# EAGLE schematic muneeb_v3 (EAGLE 9.7.0)
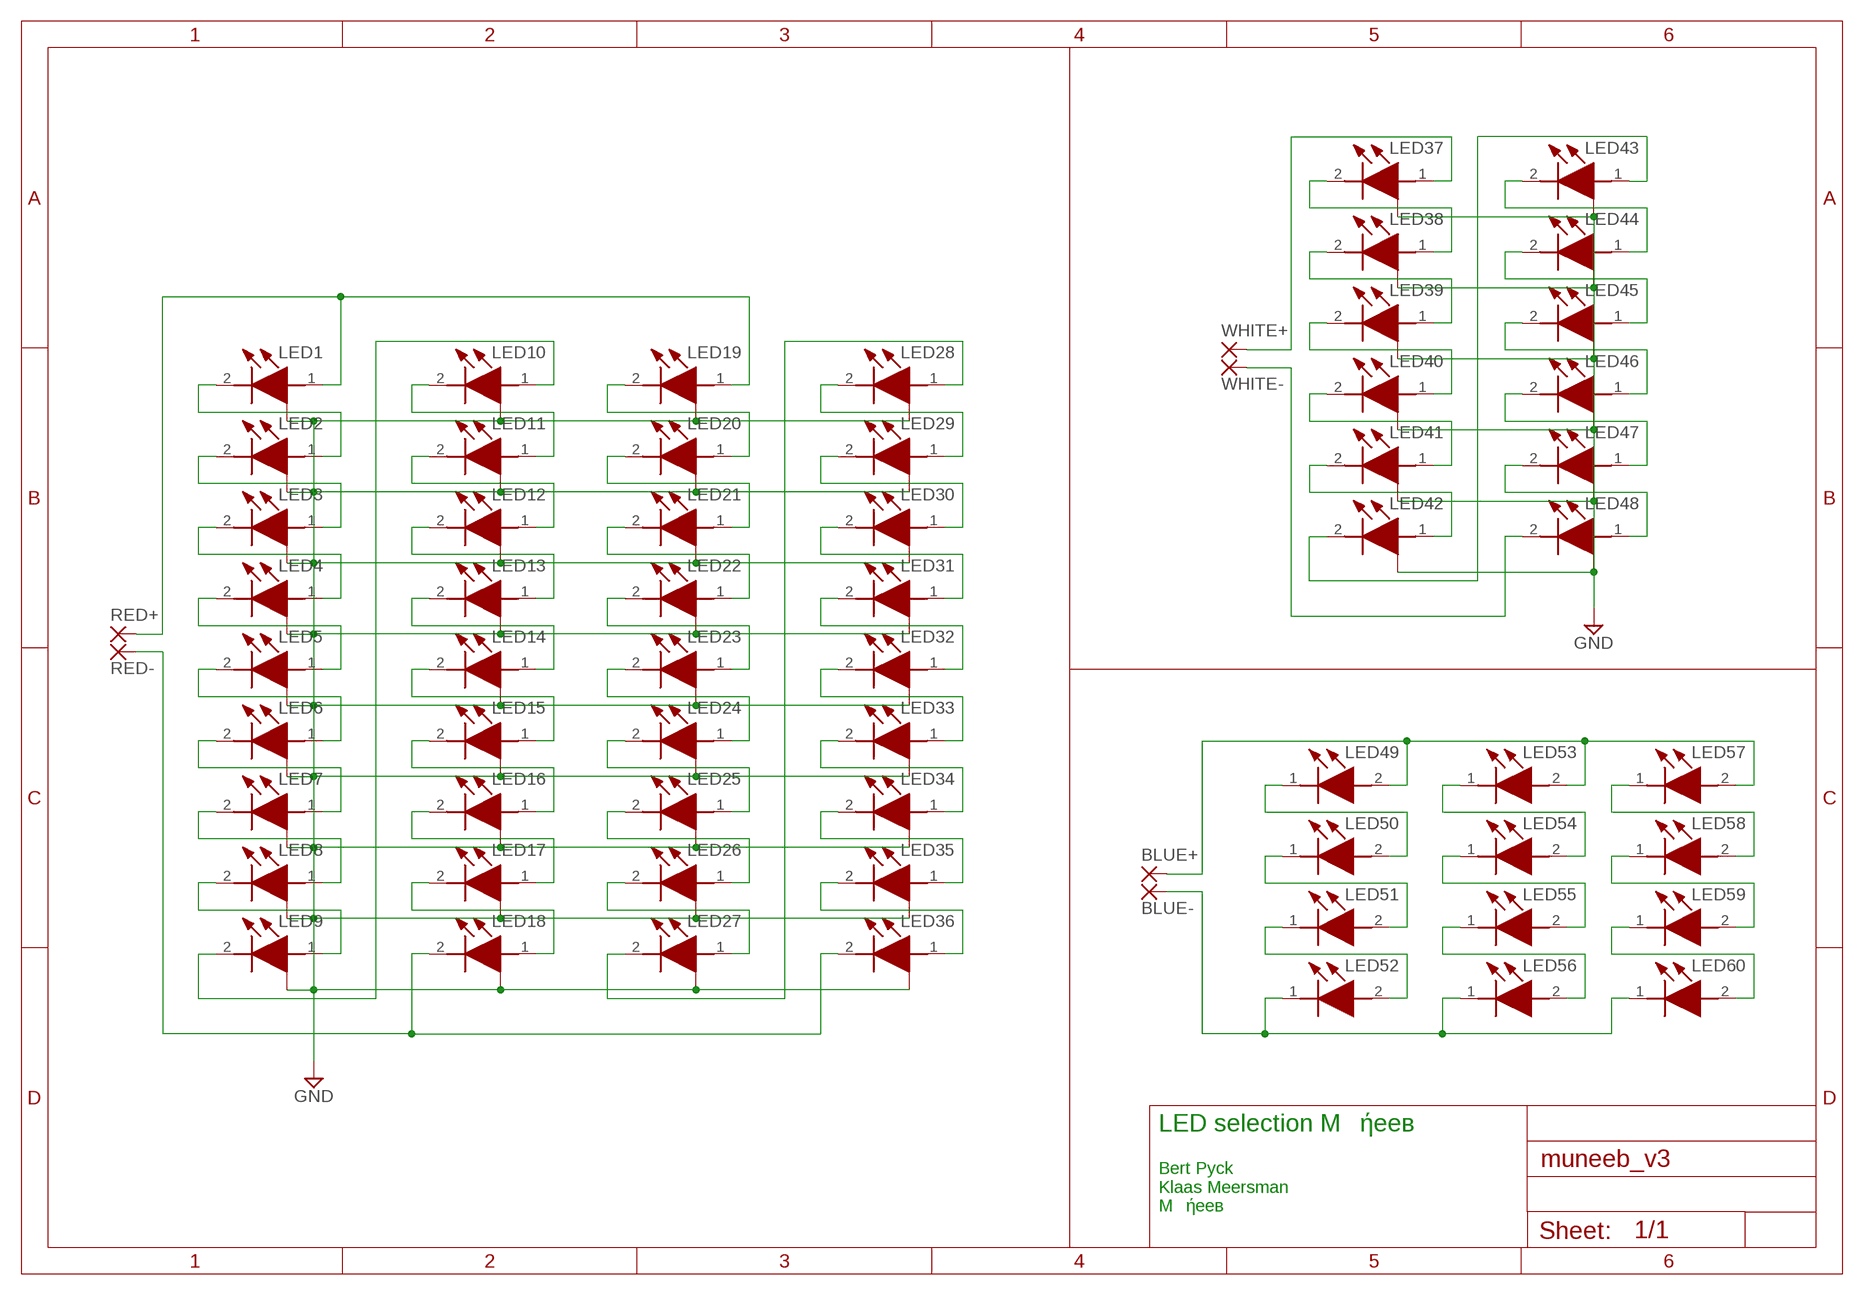
[diagram p0: schematic, sheet 1]

## Parts
BLUE+  SOLDERPAD  [SOLDERPAD]
BLUE-  SOLDERPAD  [SOLDERPAD]
LED1  RED  [GR_CSSRML.24]
LED2  RED  [GR_CSSRML.24]
LED3  RED  [GR_CSSRML.24]
LED4  RED  [GR_CSSRML.24]
LED5  RED  [GR_CSSRML.24]
LED6  RED  [GR_CSSRML.24]
LED7  RED  [GR_CSSRML.24]
LED8  RED  [GR_CSSRML.24]
LED9  RED  [GR_CSSRML.24]
LED10  RED  [GR_CSSRML.24]
LED11  RED  [GR_CSSRML.24]
LED12  RED  [GR_CSSRML.24]
LED13  RED  [GR_CSSRML.24]
LED14  RED  [GR_CSSRML.24]
LED15  RED  [GR_CSSRML.24]
LED16  RED  [GR_CSSRML.24]
LED17  RED  [GR_CSSRML.24]
LED18  RED  [GR_CSSRML.24]
LED19  RED  [GR_CSSRML.24]
LED20  RED  [GR_CSSRML.24]
LED21  RED  [GR_CSSRML.24]
LED22  RED  [GR_CSSRML.24]
LED23  RED  [GR_CSSRML.24]
LED24  RED  [GR_CSSRML.24]
LED25  RED  [GR_CSSRML.24]
LED26  RED  [GR_CSSRML.24]
LED27  RED  [GR_CSSRML.24]
LED28  RED  [GR_CSSRML.24]
LED29  RED  [GR_CSSRML.24]
LED30  RED  [GR_CSSRML.24]
LED31  RED  [GR_CSSRML.24]
LED32  RED  [GR_CSSRML.24]
LED33  RED  [GR_CSSRML.24]
LED34  RED  [GR_CSSRML.24]
LED35  RED  [GR_CSSRML.24]
LED36  RED  [GR_CSSRML.24]
LED37  WHITE  [GR_CSSRML.24]
LED38  WHITE  [GR_CSSRML.24]
LED39  WHITE  [GR_CSSRML.24]
LED40  WHITE  [GR_CSSRML.24]
LED41  WHITE  [GR_CSSRML.24]
LED42  WHITE  [GR_CSSRML.24]
LED43  WHITE  [GR_CSSRML.24]
LED44  WHITE  [GR_CSSRML.24]
LED45  WHITE  [GR_CSSRML.24]
LED46  WHITE  [GR_CSSRML.24]
LED47  WHITE  [GR_CSSRML.24]
LED48  WHITE  [GR_CSSRML.24]
LED49  BLUE  [GD_JTLPSI1.14]
LED50  BLUE  [GD_JTLPSI1.14]
LED51  BLUE  [GD_JTLPSI1.14]
LED52  BLUE  [GD_JTLPSI1.14]
LED53  BLUE  [GD_JTLPSI1.14]
LED54  BLUE  [GD_JTLPSI1.14]
LED55  BLUE  [GD_JTLPSI1.14]
LED56  BLUE  [GD_JTLPSI1.14]
LED57  BLUE  [GD_JTLPSI1.14]
LED58  BLUE  [GD_JTLPSI1.14]
LED59  BLUE  [GD_JTLPSI1.14]
LED60  BLUE  [GD_JTLPSI1.14]
RED+  SOLDERPAD  [SOLDERPAD]
RED-  SOLDERPAD  [SOLDERPAD]
WHITE+  SOLDERPAD  [SOLDERPAD]
WHITE-  SOLDERPAD  [SOLDERPAD]

## Nets
GND: LED1.GND LED1.P$1(GND) LED1.P$3(GND) LED1.P$5(GND) LED1.P$6(GND) LED1.P$7(GND) LED1.P$8(GND) LED1.P$9(GND) LED1.P$11(GND) LED1.P$12(GND) LED1.P$13(GND) LED1.P$14(GND) LED1.P$15(GND) LED2.GND LED2.P$1(GND) LED2.P$3(GND) LED2.P$5(GND) LED2.P$6(GND) LED2.P$7(GND) LED2.P$8(GND) LED2.P$9(GND) LED2.P$11(GND) LED2.P$12(GND) LED2.P$13(GND) LED2.P$14(GND) LED2.P$15(GND) LED3.GND LED3.P$1(GND) LED3.P$3(GND) LED3.P$5(GND) LED3.P$6(GND) LED3.P$7(GND) LED3.P$8(GND) LED3.P$9(GND) LED3.P$11(GND) LED3.P$12(GND) LED3.P$13(GND) LED3.P$14(GND) LED3.P$15(GND) LED4.GND LED4.P$1(GND) LED4.P$3(GND) LED4.P$5(GND) LED4.P$6(GND) LED4.P$7(GND) LED4.P$8(GND) LED4.P$9(GND) LED4.P$11(GND) LED4.P$12(GND) LED4.P$13(GND) LED4.P$14(GND) LED4.P$15(GND) LED5.GND LED5.P$1(GND) LED5.P$3(GND) LED5.P$5(GND) LED5.P$6(GND) LED5.P$7(GND) LED5.P$8(GND) LED5.P$9(GND) LED5.P$11(GND) LED5.P$12(GND) LED5.P$13(GND) LED5.P$14(GND) LED5.P$15(GND) LED6.GND LED6.P$1(GND) LED6.P$3(GND) LED6.P$5(GND) LED6.P$6(GND) LED6.P$7(GND) LED6.P$8(GND) LED6.P$9(GND) LED6.P$11(GND) LED6.P$12(GND) LED6.P$13(GND) LED6.P$14(GND) LED6.P$15(GND) LED7.GND LED7.P$1(GND) LED7.P$3(GND) LED7.P$5(GND) LED7.P$6(GND) LED7.P$7(GND) LED7.P$8(GND) LED7.P$9(GND) LED7.P$11(GND) LED7.P$12(GND) LED7.P$13(GND) LED7.P$14(GND) LED7.P$15(GND) LED8.GND LED8.P$1(GND) LED8.P$3(GND) LED8.P$5(GND) LED8.P$6(GND) LED8.P$7(GND) LED8.P$8(GND) LED8.P$9(GND) LED8.P$11(GND) LED8.P$12(GND) LED8.P$13(GND) LED8.P$14(GND) LED8.P$15(GND) LED9.GND LED9.P$1(GND) LED9.P$3(GND) LED9.P$5(GND) LED9.P$6(GND) LED9.P$7(GND) LED9.P$8(GND) LED9.P$9(GND) LED9.P$11(GND) LED9.P$12(GND) LED9.P$13(GND) LED9.P$14(GND) LED9.P$15(GND) LED10.GND LED10.P$1(GND) LED10.P$3(GND) LED10.P$5(GND) LED10.P$6(GND) LED10.P$7(GND) LED10.P$8(GND) LED10.P$9(GND) LED10.P$11(GND) LED10.P$12(GND) LED10.P$13(GND) LED10.P$14(GND) LED10.P$15(GND) LED11.GND LED11.P$1(GND) LED11.P$3(GND) LED11.P$5(GND) LED11.P$6(GND) LED11.P$7(GND) LED11.P$8(GND) LED11.P$9(GND) LED11.P$11(GND) LED11.P$12(GND) LED11.P$13(GND) LED11.P$14(GND) LED11.P$15(GND) LED12.GND LED12.P$1(GND) LED12.P$3(GND) LED12.P$5(GND) LED12.P$6(GND) LED12.P$7(GND) LED12.P$8(GND) LED12.P$9(GND) LED12.P$11(GND) LED12.P$12(GND) LED12.P$13(GND) LED12.P$14(GND) LED12.P$15(GND) LED13.GND LED13.P$1(GND) LED13.P$3(GND) LED13.P$5(GND) LED13.P$6(GND) LED13.P$7(GND) LED13.P$8(GND) LED13.P$9(GND) LED13.P$11(GND) LED13.P$12(GND) LED13.P$13(GND) LED13.P$14(GND) LED13.P$15(GND) LED14.GND LED14.P$1(GND) LED14.P$3(GND) LED14.P$5(GND) LED14.P$6(GND) LED14.P$7(GND) LED14.P$8(GND) LED14.P$9(GND) LED14.P$11(GND) LED14.P$12(GND) LED14.P$13(GND) LED14.P$14(GND) LED14.P$15(GND) LED15.GND LED15.P$1(GND) LED15.P$3(GND) LED15.P$5(GND) LED15.P$6(GND) LED15.P$7(GND) LED15.P$8(GND) LED15.P$9(GND) LED15.P$11(GND) LED15.P$12(GND) LED15.P$13(GND) LED15.P$14(GND) LED15.P$15(GND) LED16.GND LED16.P$1(GND) LED16.P$3(GND) LED16.P$5(GND) LED16.P$6(GND) LED16.P$7(GND) LED16.P$8(GND) LED16.P$9(GND) LED16.P$11(GND) LED16.P$12(GND) LED16.P$13(GND) LED16.P$14(GND) LED16.P$15(GND) LED17.GND LED17.P$1(GND) LED17.P$3(GND) LED17.P$5(GND) LED17.P$6(GND) LED17.P$7(GND) LED17.P$8(GND) LED17.P$9(GND) LED17.P$11(GND) LED17.P$12(GND) LED17.P$13(GND) LED17.P$14(GND) LED17.P$15(GND) LED18.GND LED18.P$1(GND) LED18.P$3(GND) LED18.P$5(GND) LED18.P$6(GND) LED18.P$7(GND) LED18.P$8(GND) LED18.P$9(GND) LED18.P$11(GND) LED18.P$12(GND) LED18.P$13(GND) LED18.P$14(GND) LED18.P$15(GND) LED19.GND LED19.P$1(GND) LED19.P$3(GND) LED19.P$5(GND) LED19.P$6(GND) LED19.P$7(GND) LED19.P$8(GND) LED19.P$9(GND) LED19.P$11(GND) LED19.P$12(GND) LED19.P$13(GND) LED19.P$14(GND) LED19.P$15(GND) LED20.GND LED20.P$1(GND) LED20.P$3(GND) LED20.P$5(GND) LED20.P$6(GND) LED20.P$7(GND) LED20.P$8(GND) LED20.P$9(GND) LED20.P$11(GND) LED20.P$12(GND) LED20.P$13(GND) LED20.P$14(GND) LED20.P$15(GND) LED21.GND LED21.P$1(GND) LED21.P$3(GND) LED21.P$5(GND) LED21.P$6(GND) LED21.P$7(GND) LED21.P$8(GND) LED21.P$9(GND) LED21.P$11(GND) LED21.P$12(GND) LED21.P$13(GND) LED21.P$14(GND) LED21.P$15(GND) LED22.GND LED22.P$1(GND) LED22.P$3(GND) LED22.P$5(GND) LED22.P$6(GND) LED22.P$7(GND) LED22.P$8(GND) LED22.P$9(GND) LED22.P$11(GND) LED22.P$12(GND) LED22.P$13(GND) LED22.P$14(GND) LED22.P$15(GND) LED23.GND LED23.P$1(GND) LED23.P$3(GND) LED23.P$5(GND) LED23.P$6(GND) LED23.P$7(GND) LED23.P$8(GND) LED23.P$9(GND) LED23.P$11(GND) LED23.P$12(GND) LED23.P$13(GND) LED23.P$14(GND) LED23.P$15(GND) LED24.GND LED24.P$1(GND) LED24.P$3(GND) LED24.P$5(GND) LED24.P$6(GND) LED24.P$7(GND) LED24.P$8(GND) LED24.P$9(GND) LED24.P$11(GND) LED24.P$12(GND) LED24.P$13(GND) LED24.P$14(GND) LED24.P$15(GND) LED25.GND LED25.P$1(GND) LED25.P$3(GND) LED25.P$5(GND) LED25.P$6(GND) LED25.P$7(GND) LED25.P$8(GND) LED25.P$9(GND) LED25.P$11(GND) LED25.P$12(GND) LED25.P$13(GND) LED25.P$14(GND) LED25.P$15(GND) LED26.GND LED26.P$1(GND) LED26.P$3(GND) LED26.P$5(GND) LED26.P$6(GND) LED26.P$7(GND) LED26.P$8(GND) LED26.P$9(GND) LED26.P$11(GND) LED26.P$12(GND) LED26.P$13(GND) LED26.P$14(GND) LED26.P$15(GND) LED27.GND LED27.P$1(GND) LED27.P$3(GND) LED27.P$5(GND) LED27.P$6(GND) LED27.P$7(GND) LED27.P$8(GND) LED27.P$9(GND) LED27.P$11(GND) LED27.P$12(GND) LED27.P$13(GND) LED27.P$14(GND) LED27.P$15(GND) LED28.GND LED28.P$1(GND) LED28.P$3(GND) LED28.P$5(GND) LED28.P$6(GND) LED28.P$7(GND) LED28.P$8(GND) LED28.P$9(GND) LED28.P$11(GND) LED28.P$12(GND) LED28.P$13(GND) LED28.P$14(GND) LED28.P$15(GND) LED29.GND LED29.P$1(GND) LED29.P$3(GND) LED29.P$5(GND) LED29.P$6(GND) LED29.P$7(GND) LED29.P$8(GND) LED29.P$9(GND) LED29.P$11(GND) LED29.P$12(GND) LED29.P$13(GND) LED29.P$14(GND) LED29.P$15(GND) LED30.GND LED30.P$1(GND) LED30.P$3(GND) LED30.P$5(GND) LED30.P$6(GND) LED30.P$7(GND) LED30.P$8(GND) LED30.P$9(GND) LED30.P$11(GND) LED30.P$12(GND) LED30.P$13(GND) LED30.P$14(GND) LED30.P$15(GND) LED31.GND LED31.P$1(GND) LED31.P$3(GND) LED31.P$5(GND) LED31.P$6(GND) LED31.P$7(GND) LED31.P$8(GND) LED31.P$9(GND) LED31.P$11(GND) LED31.P$12(GND) LED31.P$13(GND) LED31.P$14(GND) LED31.P$15(GND) LED32.GND LED32.P$1(GND) LED32.P$3(GND) LED32.P$5(GND) LED32.P$6(GND) LED32.P$7(GND) LED32.P$8(GND) LED32.P$9(GND) LED32.P$11(GND) LED32.P$12(GND) LED32.P$13(GND) LED32.P$14(GND) LED32.P$15(GND) LED33.GND LED33.P$1(GND) LED33.P$3(GND) LED33.P$5(GND) LED33.P$6(GND) LED33.P$7(GND) LED33.P$8(GND) LED33.P$9(GND) LED33.P$11(GND) LED33.P$12(GND) LED33.P$13(GND) LED33.P$14(GND) LED33.P$15(GND) LED34.GND LED34.P$1(GND) LED34.P$3(GND) LED34.P$5(GND) LED34.P$6(GND) LED34.P$7(GND) LED34.P$8(GND) LED34.P$9(GND) LED34.P$11(GND) LED34.P$12(GND) LED34.P$13(GND) LED34.P$14(GND) LED34.P$15(GND) LED35.GND LED35.P$1(GND) LED35.P$3(GND) LED35.P$5(GND) LED35.P$6(GND) LED35.P$7(GND) LED35.P$8(GND) LED35.P$9(GND) LED35.P$11(GND) LED35.P$12(GND) LED35.P$13(GND) LED35.P$14(GND) LED35.P$15(GND) LED36.GND LED36.P$1(GND) LED36.P$3(GND) LED36.P$5(GND) LED36.P$6(GND) LED36.P$7(GND) LED36.P$8(GND) LED36.P$9(GND) LED36.P$11(GND) LED36.P$12(GND) LED36.P$13(GND) LED36.P$14(GND) LED36.P$15(GND) LED37.GND LED37.P$1(GND) LED37.P$3(GND) LED37.P$5(GND) LED37.P$6(GND) LED37.P$7(GND) LED37.P$8(GND) LED37.P$9(GND) LED37.P$11(GND) LED37.P$12(GND) LED37.P$13(GND) LED37.P$14(GND) LED37.P$15(GND) LED38.GND LED38.P$1(GND) LED38.P$3(GND) LED38.P$5(GND) LED38.P$6(GND) LED38.P$7(GND) LED38.P$8(GND) LED38.P$9(GND) LED38.P$11(GND) LED38.P$12(GND) LED38.P$13(GND) LED38.P$14(GND) LED38.P$15(GND) LED39.GND LED39.P$1(GND) LED39.P$3(GND) LED39.P$5(GND) LED39.P$6(GND) LED39.P$7(GND) LED39.P$8(GND) LED39.P$9(GND) LED39.P$11(GND) LED39.P$12(GND) LED39.P$13(GND) LED39.P$14(GND) LED39.P$15(GND) LED40.GND LED40.P$1(GND) LED40.P$3(GND) LED40.P$5(GND) LED40.P$6(GND) LED40.P$7(GND) LED40.P$8(GND) LED40.P$9(GND) LED40.P$11(GND) LED40.P$12(GND) LED40.P$13(GND) LED40.P$14(GND) LED40.P$15(GND) LED41.GND LED41.P$1(GND) LED41.P$3(GND) LED41.P$5(GND) LED41.P$6(GND) LED41.P$7(GND) LED41.P$8(GND) LED41.P$9(GND) LED41.P$11(GND) LED41.P$12(GND) LED41.P$13(GND) LED41.P$14(GND) LED41.P$15(GND) LED42.GND LED42.P$1(GND) LED42.P$3(GND) LED42.P$5(GND) LED42.P$6(GND) LED42.P$7(GND) LED42.P$8(GND) LED42.P$9(GND) LED42.P$11(GND) LED42.P$12(GND) LED42.P$13(GND) LED42.P$14(GND) LED42.P$15(GND) LED43.GND LED43.P$1(GND) LED43.P$3(GND) LED43.P$5(GND) LED43.P$6(GND) LED43.P$7(GND) LED43.P$8(GND) LED43.P$9(GND) LED43.P$11(GND) LED43.P$12(GND) LED43.P$13(GND) LED43.P$14(GND) LED43.P$15(GND) LED44.GND LED44.P$1(GND) LED44.P$3(GND) LED44.P$5(GND) LED44.P$6(GND) LED44.P$7(GND) LED44.P$8(GND) LED44.P$9(GND) LED44.P$11(GND) LED44.P$12(GND) LED44.P$13(GND) LED44.P$14(GND) LED44.P$15(GND) LED45.GND LED45.P$1(GND) LED45.P$3(GND) LED45.P$5(GND) LED45.P$6(GND) LED45.P$7(GND) LED45.P$8(GND) LED45.P$9(GND) LED45.P$11(GND) LED45.P$12(GND) LED45.P$13(GND) LED45.P$14(GND) LED45.P$15(GND) LED46.GND LED46.P$1(GND) LED46.P$3(GND) LED46.P$5(GND) LED46.P$6(GND) LED46.P$7(GND) LED46.P$8(GND) LED46.P$9(GND) LED46.P$11(GND) LED46.P$12(GND) LED46.P$13(GND) LED46.P$14(GND) LED46.P$15(GND) LED47.GND LED47.P$1(GND) LED47.P$3(GND) LED47.P$5(GND) LED47.P$6(GND) LED47.P$7(GND) LED47.P$8(GND) LED47.P$9(GND) LED47.P$11(GND) LED47.P$12(GND) LED47.P$13(GND) LED47.P$14(GND) LED47.P$15(GND) LED48.GND LED48.P$1(GND) LED48.P$3(GND) LED48.P$5(GND) LED48.P$6(GND) LED48.P$7(GND) LED48.P$8(GND) LED48.P$9(GND) LED48.P$11(GND) LED48.P$12(GND) LED48.P$13(GND) LED48.P$14(GND) LED48.P$15(GND)
N$1: LED1.1(A) LED19.1(A) RED+.1(P)
N$2: LED1.2(K) LED2.1(A)
N$3: LED37.1(A) WHITE+.1(P)
N$4: LED48.2(K) WHITE-.1(P)
N$5: LED37.2(K) LED38.1(A)
N$6: LED38.2(K) LED39.1(A)
N$7: LED39.2(K) LED40.1(A)
N$8: LED40.2(K) LED41.1(A)
N$9: LED41.2(K) LED42.1(A)
N$10: LED42.2(K) LED43.1(A)
N$12: LED2.2(K) LED3.1(A)
N$13: LED3.2(K) LED4.1(A)
N$14: LED4.2(K) LED5.1(A)
N$15: LED5.2(K) LED6.1(A)
N$16: LED6.2(K) LED7.1(A)
N$17: LED43.2(K) LED44.1(A)
N$18: LED44.2(K) LED45.1(A)
N$19: LED45.2(K) LED46.1(A)
N$20: LED46.2(K) LED47.1(A)
N$21: BLUE+.1(P) LED49.2(A) LED53.2(A) LED57.2(A)
N$22: LED7.2(K) LED8.1(A)
N$23: BLUE-.1(P) LED52.1(K) LED56.1(K) LED60.1(K)
N$24: LED8.2(K) LED9.1(A)
N$25: LED10.2(K) LED11.1(A)
N$26: LED11.2(K) LED12.1(A)
N$27: LED12.2(K) LED13.1(A)
N$28: LED13.2(K) LED14.1(A)
N$29: LED49.1(K) LED50.2(A)
N$30: LED19.2(K) LED20.1(A)
N$31: LED20.2(K) LED21.1(A)
N$32: LED50.1(K) LED51.2(A)
N$33: LED51.1(K) LED52.2(A)
N$34: LED53.1(K) LED54.2(A)
N$35: LED14.2(K) LED15.1(A)
N$36: LED15.2(K) LED16.1(A)
N$37: LED16.2(K) LED17.1(A)
N$38: LED17.2(K) LED18.1(A)
N$39: LED54.1(K) LED55.2(A)
N$40: LED55.1(K) LED56.2(A)
N$41: LED57.1(K) LED58.2(A)
N$42: LED58.1(K) LED59.2(A)
N$43: LED59.1(K) LED60.2(A)
N$44: LED47.2(K) LED48.1(A)
N$46: LED18.2(K) LED36.2(K) RED-.1(P)
N$47: LED9.2(K) LED10.1(A)
N$48: LED21.2(K) LED22.1(A)
N$49: LED22.2(K) LED23.1(A)
N$50: LED23.2(K) LED24.1(A)
N$51: LED24.2(K) LED25.1(A)
N$52: LED25.2(K) LED26.1(A)
N$53: LED26.2(K) LED27.1(A)
N$54: LED28.2(K) LED29.1(A)
N$55: LED29.2(K) LED30.1(A)
N$56: LED30.2(K) LED31.1(A)
N$57: LED31.2(K) LED32.1(A)
N$58: LED32.2(K) LED33.1(A)
N$59: LED33.2(K) LED34.1(A)
N$60: LED34.2(K) LED35.1(A)
N$61: LED35.2(K) LED36.1(A)
N$63: LED27.2(K) LED28.1(A)

## Notes on the sheet
- LED selection M𝔲ήeeв
- Bert Pyck
  Klaas Meersman
  M𝔲ήeeв

## Library data of the parts
BLUE+ BLUE- RED+ RED- WHITE+ WHITE- = LibraryLEDs:SOLDERPAD: SMD PAD
LED1-LED36 = OSRAM LED:RED: Deep Red 650-670nm Source: Datasheet <https://otmm.lumileds.com/adaptivemedia/f0665283471a2a639ce8c3006456265ad074bde9>
LED37-LED48 = OSRAM LED:WHITE: Horticulture White Source: Datasheet <https://otmm.lumileds.com/adaptivemedia/f0665283471a2a639ce8c3006456265ad074bde9>
LED49-LED60 = OSRAM LED:BLUE: Royal Blue 440-455nm Source: Datasheet <https://otmm.lumileds.com/adaptivemedia/f0665283471a2a639ce8c3006456265ad074bde9>; DESCRIPTION: High Power LEDs - Single Color 2835 Mid-Power ColorFar Red 720-740nm; HEIGHT: mm; MANUFACTURER_NAME: CREE LED; MANUFACTURER_PART_NUMBER: JE2835AFR-N-0001A0000-N0000001; MOUSER_PART_NUMBER: 941-JE2835AFRN01AN; MOUSER_PRICE-STOCK: https://www.mouser.co.uk/ProductDetail/Cree-LED/JE2835AFR-N-0001A0000-N0000001?qs=tlsG%2FOw5FFhxeS5Ond46kw%3D%3D

## Net classes
0 default: width 0.5 mm, drill 0.3 mm, clearance 0.1 mm